# Altium project ESP32_S3.PrjPcb
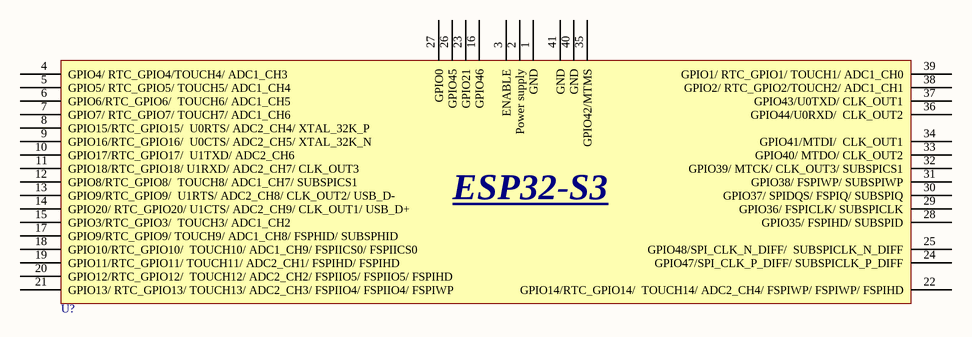
[diagram p0: ESP32_S3.SchDoc]
1 sheet, 1 parts. Net scope: global (net labels, ports and power ports of the same name join across sheets).
Board file: ESP32_PCB.PcbDoc

## Sheet ESP32_S3.SchDoc
size A4; SheetNumber: 1; SheetTotal: 1

### Parts
U?  Access violation at address 00000001433CB4E8 in module in altium  (value not drawn)

### Nets

Not connected (* = marked no-connect by the designer): U? 1(GND) 2(Power_supply) 3(ENABLE) 4(GPIO4/_RTC_GPIO4/TOUCH4/_ADC1_CH3) 5(GPIO5/_RTC_GPIO5/_TOUCH5/_ADC1_CH4) 6(GPIO6/RTC_GPIO6/__TOUCH6/_ADC1_CH5) 7(GPIO7/_RTC_GPIO7/_TOUCH7/_ADC1_CH6) 8(GPIO15/RTC_GPIO15/__U0RTS/_ADC2_CH4/_XTAL_32K_P) 9(GPIO16/RTC_GPIO16/__U0CTS/_ADC2_CH5/_XTAL_32K_N) 10(GPIO17/RTC_GPIO17/__U1TXD/_ADC2_CH6) 11(GPIO18/RTC_GPIO18/_U1RXD/_ADC2_CH7/_CLK_OUT3) 12(GPIO8/RTC_GPIO8/__TOUCH8/_ADC1_CH7/_SUBSPICS1) 13(GPIO9/RTC_GPIO9/__U1RTS/_ADC2_CH8/_CLK_OUT2/_USB_D-) 14(GPIO20/_RTC_GPIO20/_U1CTS/_ADC2_CH9/_CLK_OUT1/_USB_D+) 15(GPIO3/RTC_GPIO3/__TOUCH3/_ADC1_CH2) 16(GPIO46) 17(GPIO9/RTC_GPIO9/_TOUCH9/_ADC1_CH8/_FSPHID/_SUBSPHID) 18(GPIO10/RTC_GPIO10/__TOUCH10/_ADC1_CH9/_FSPIICS0/_FSPIICS0) 19(GPIO11/RTC_GPIO11/_TOUCH11/_ADC2_CH1/_FSPIHD/_FSPIHD) 20(GPIO12/RTC_GPIO12/__TOUCH12/_ADC2_CH2/_FSPIIO5/_FSPIIO5/_FSPIHD) 21(GPIO13/_RTC_GPIO13/_TOUCH13/_ADC2_CH3/_FSPIIO4/_FSPIIO4/_FSPIWP) 22(GPIO14/RTC_GPIO14/__TOUCH14/_ADC2_CH4/_FSPIWP/_FSPIWP/_FSPIHD) 23(GPIO21) 24(GPIO47/SPI_CLK_P_DIFF/_SUBSPICLK_P_DIFF) 25(GPIO48/SPI_CLK_N_DIFF/__SUBSPICLK_N_DIFF) 26(GPIO45) 27(GPIO0) 28(GPIO35/_FSPIHD/_SUBSPID) 29(GPIO36/_FSPICLK/_SUBSPICLK) 30(GPIO37/_SPIDQS/_FSPIQ/_SUBSPIQ) 31(GPIO38/_FSPIWP/_SUBSPIWP) 32(GPIO39/_MTCK/_CLK_OUT3/_SUBSPICS1) 33(GPIO40/_MTDO/_CLK_OUT2) 34(GPIO41/MTDI/__CLK_OUT1) 35(GPIO42/MTMS) 36(GPIO44/U0RXD/__CLK_OUT2) 37(GPIO43/U0TXD/_CLK_OUT1) 38(GPIO2/_RTC_GPIO2/TOUCH2/_ADC1_CH1) 39(GPIO1/_RTC_GPIO1/_TOUCH1/_ADC1_CH0) 40(GND) 41(GND)

### Notes on the sheet
- (in symbol ESP32-S3-WROOM-1(N16)) ESP32-S3

### Library data of the parts
U? = ESP32-S3-WROOM-1(N16): Telecom Circuit, 1-Func; Manufacturer: Espressif Systems; Supplier: Digikey; Supplier Part Number: 1965-ESP32-S3-WROOM-1-N16CT-ND; Manufacturer Part Number: ESP32-S3-WROOM-1(N16); RoHS: No; Category: LDO; Stock: 4589; Pricing: 1=3.48 (USD)